# Altium schematic sheet 1_PWR_1.SchDoc
size 419 x 296 mm; Author: Serbinov O.A.; CompanyName: ELSICOM; DrawnBy: Serbinov O.A.; Engineer: Serbinov O.A.; Organization: Elsicom; Address1: Kirova avenue, 58; Address2: Tomsk; Address3: Russia 634012; DocumentNumber: 2; SheetNumber: 2; SheetTotal: 44; ProjectName: 48_PORTS
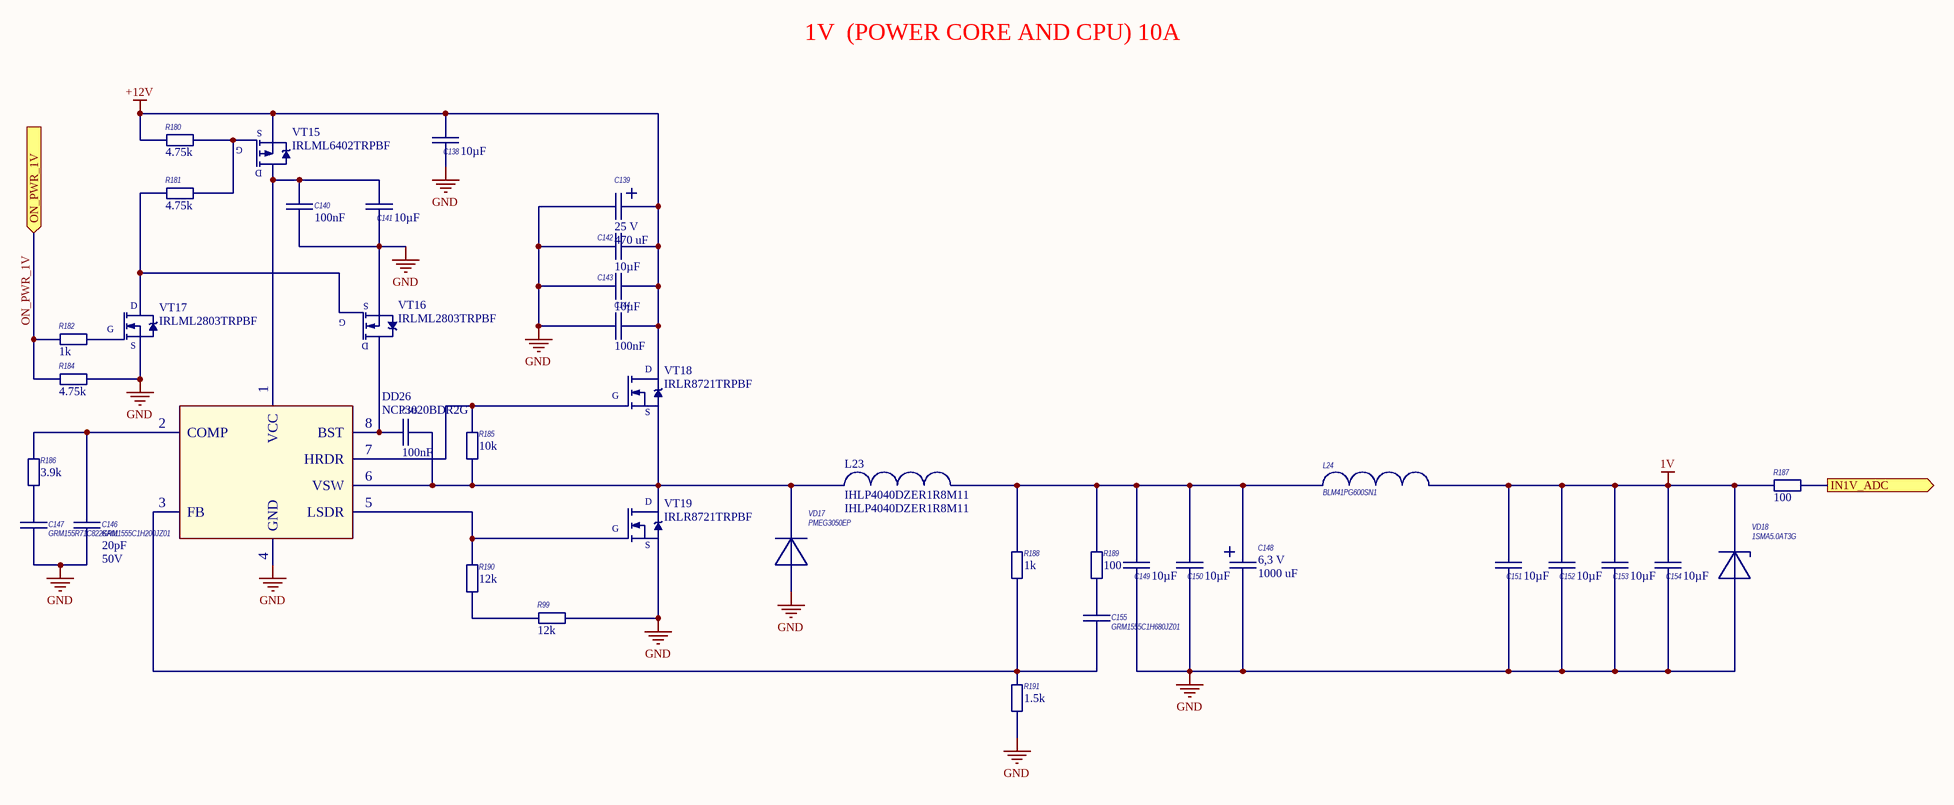
[diagram p0: 1_PWR_1.SchDoc]

## Parts
C138  Capacitance: 10µF  [CAPC2012[0805]]  (hidden comment: GRM21BR61C106KE15)
C139  Voltage Rating: 25 V  Capacitance: 470 uF  [CAP SMD 1010]  (hidden comment: CA025M0470REG-1010)
C140  Capacitance: 100nF  [C0402_IPC High Density]  (hidden comment: GRM155R71E104KE14D)
C141  Capacitance: 10µF  [CAPC2012[0805]]  (hidden comment: GRM21BR61C106KE15)
C142  Capacitance: 10µF  [CAPC2012[0805]]  (hidden comment: GRM21BR61C106KE15)
C143  Capacitance: 10µF  [CAPC2012[0805]]  (hidden comment: GRM21BR61C106KE15)
C144  Capacitance: 100nF  [C0402_IPC High Density]  (hidden comment: GRM155R71E104KE14D)
C145  Capacitance: 100nF  [C0402_IPC High Density]  (hidden comment: GRM155R71E104KE14D)
C146  GRM1555C1H200JZ01  Capacitance: 20pF  Voltage - Rated: 50V  [CAPC1005[0402]]
C147  GRM155R71C822KA01  [CAPC1005[0402]]
C148  Voltage Rating: 6,3 V  Capacitance: 1000 uF  [CAP SMD 1010]  (hidden comment: CA006M1000REG-1010)
C149  Capacitance: 10µF  [CAPC2012[0805]]  (hidden comment: GRM21BR61C106KE15)
C150  Capacitance: 10µF  [CAPC2012[0805]]  (hidden comment: GRM21BR61C106KE15)
C151  Capacitance: 10µF  [CAPC2012[0805]]  (hidden comment: GRM21BR61C106KE15)
C152  Capacitance: 10µF  [CAPC2012[0805]]  (hidden comment: GRM21BR61C106KE15)
C153  Capacitance: 10µF  [CAPC2012[0805]]  (hidden comment: GRM21BR61C106KE15)
C154  Capacitance: 10µF  [CAPC2012[0805]]  (hidden comment: GRM21BR61C106KE15)
C155  GRM1555C1H680JZ01  [CAPC1005[0402]]
DD26  NCP3020BDR2G  [751-07_N]
L23  IHLP4040DZER1R8M11  [IHLP4040DZ]
L24  BLM41PG600SN1  [BLM41P]
R99  Resistance (Ohms): 12k  [R0402_IPC High Density]  (hidden comment: ERJ-2RKF1202X)
R180  Resistance (Ohms): 4.75k  [R0402_IPC High Density]  (hidden comment: ERJ-2RKF4751X)
R181  Resistance (Ohms): 4.75k  [R0402_IPC High Density]  (hidden comment: ERJ-2RKF4751X)
R182  Resistance: 1k  [R0402_IPC High Density]  (hidden comment: ERJ-2RKF1001X)
R184  Resistance (Ohms): 4.75k  [R0402_IPC High Density]  (hidden comment: ERJ-2RKF4751X)
R185  Resistance: 10k  [R0402_IPC High Density]  (hidden comment: ERJ-2RKF1002X)
R186  Resistance: 3.9k  [R0402_IPC High Density]  (hidden comment: ERJ-2RKF3901X)
R187  Resistance: 100  [R0402_IPC High Density]  (hidden comment: ERJ-2RKF1000X)
R188  Resistance: 1k  [R0402_IPC High Density]  (hidden comment: ERJ-2RKF1001X)
R189  Resistance: 100  [R0402_IPC High Density]  (hidden comment: ERJ-2RKF1000X)
R190  Resistance (Ohms): 12k  [R0402_IPC High Density]  (hidden comment: ERJ-2RKF1202X)
R191  Resistance (Ohms): 1.5k  [R0402_IPC High Density]  (hidden comment: ERJ-2RKF1501X)
VD17  PMEG3050EP  [SOD128]
VD18  1SMA5.0AT3G  [SMA]
VT15  IRLML6402TRPBF  [SOT-23]
VT16  IRLML2803TRPBF  [SOT-23]
VT17  IRLML2803TRPBF  [SOT-23]
VT18  IRLR8721TRPBF  [D-PAK (TO-252AA)]
VT19  IRLR8721TRPBF  [D-PAK (TO-252AA)]

## Ports
IN1V_ADC (out), ON_PWR_1V (in)

## Nets
1V: C151.2 C152.2 C153.2 C154.2 L24.2 R187.1 VD18.1
+12V: C138.2 C139.2 C142.2 C143.2 C144.1 R180.2 VT15.2(S) VT18.3(D)
GND: C138.1 C139.1 C140.1 C141.1 C142.1 C143.1 C144.2 C146.1 C147.1 C148.1 C149.1 C150.1 C151.1 C152.1 C153.1 C154.1 DD26.4(GND) R99.1 R184.1 R191.1 VD17.2 VD18.2 VT16.2(S) VT17.2(S) VT19.2(S)
IN1V_ADC: R187.2 ; port IN1V_ADC
ON_PWR_1V: R182.1 R184.2 ; port ON_PWR_1V
NetC140_2: C140.2 C141.2 DD26.1(VCC) VT15.3(D)
NetC145_1: C145.1 DD26.8(BST) VT16.3(D)
NetC145_2: C145.2 DD26.6(VSW) L23.1 R185.1 VD17.1 VT18.2(S) VT19.3(D)
NetC146_2: C146.2 DD26.2(COMP) R186.2
NetC147_2: C147.2 R186.1
NetC148_2: C148.2 C149.2 C150.2 L23.2 L24.1 R188.2 R189.2
NetC155_1: C155.1 DD26.3(FB) R188.1 R191.2
NetC155_2: C155.2 R189.1
NetDD26_5: DD26.5(LSDR) R190.2 VT19.1(G)
NetDD26_7: DD26.7(HRDR) R185.2 VT18.1(G)
NetR99_2: R99.2 R190.1
NetR180_1: R180.1 R181.1 VT15.1(G)
NetR181_2: R181.2 VT16.1(G) VT17.3(D)
NetR182_2: R182.2 VT17.1(G)

## Notes on the sheet
- 1V  (POWER CORE AND CPU) 10A
- A3
- SIZE
- PROJECT
- SHEET
- OF
- Engineer: Oleg Serbinov

## Library data of the parts
C138 C141-C143 C149-C154 = GRM21BR61C106KE15: C0805, 10uF 10%, 16V, X5R; Manufacturer: Murata; Customer Part Number: Конденсатор, 10u, 0805, 16V, X5R, 10%; Analogs: any suitable; Applications: General Purpose; Category: Capacitors; Operating Temperature: -55°C ~ 85°C; Package / Case: 0805 (2012 Metric); Size / Dimension: 0.079" L x 0.049" W (2.00mm x 1.25mm); Temperature Coefficient: X5R; Tolerance: ±10%; ComponentLink1URL: http://search.murata.co.jp/Ceramy/image/img/PDF/ENG/GRM21BR61C106KE15.pdf; ComponentLink1Description: http://search.murata.co.jp/Ceramy/image/img/PDF/ENG/GRM21BR61C106KE15.pdf; Pricing: 1=0.3, 10=0.25, 50=0.1408, 100=0.1252, 250=0.09392, 500=0.08294, 1000=0.07356 (USD); Voltage - Rated: 16V; Manufacturer Part Number: GRM21BR61C106KE15
C139 = CA025M0470REG-1010: Capacitor Aluminium SMD1010, 470uF 25V; Manufacturer: Yageo; Customer Part Number: Конденсатор электролитический, 470u, 1010, 25V; Tolerance: 20 %; Analogs: SC1E477M10010VR259, LV471M025G105ETR, 25SEV470MTM10X10,5; Supplier 1: Mouser; Standard Pack Qty: 500; Category: Aluminum Electrolytic Capacitors - SMD; Reeling: True; Supplier: Mouser; Manufacturer Part Number: CA025M0470REG-1010; Minimum Order Quantity: 1; ComponentLink1URL: http://www.yageo.com/portal/product/productDocs.jsp?YageoPartNumber=CA016M0470REG-1010; ComponentLink1Description: http://www.yageo.com/portal/product/productDocs.jsp?YageoPartNumber=CA016M0470REG-1010; Packaging: Reel; Termination Style: SMD/SMT; Supplier Part Number 1: N/A; Supplier Part Number: N/A
C140 C144 = GRM155R71E104KE14D: C0402, 100nF, 25V, X7R; Manufacturer: Murata; Rmanufacturer: Yageo  Samsung  TDK  Taiyo Yuden  Kemet; Customer Part Number: Конденсатор, 100n, 0402, 25V, X7R, 10%; Capacitance Tolerance: ± 10%; Voltage Rating: 16; Capacitor Case Style: 0402 [1005 Metric]; Capacitor Terminals: SMD; SVHC: No SVHC (19-Dec-2012); No. of Pins: 2; Reel Quantity: 10000; Tolerance +: 10%; Analogs: any suitable; Manufacturer Part Number: GRM155R71E104KE14D; RoHS: YES; Packaging: Reel; Package / Case: 0402; ComponentLink1URL: http://www.farnell.com/datasheets/4360.pdf; ComponentLink1Description: http://www.farnell.com/datasheets/4360.pdf; Pricing: 10000=0.008593, 30000=0.007991 (GBP); Supplier 1: Farnell; Supplier Part Number 1: 1118151; Stock: 3; Dielectric Characteristic: X7R; Operating Temperature Min: -55; Operating Temperature Max: 125; Operating Temperature Range: -55°C to +125; Series: GRM Hi-Cap; Terminal Type: Surface Mount (SMD, SMT); Tolerance -: 10%; Voltage Rating V DC: 16
C145 = GRM155R71E104KE14D: C0402, 100nF, 25V, X7R; Customer Part Number: Конденсатор, 100n, 0402, 25V, X7R, 10%; Manufacturer: Murata; Rmanufacturer: Yageo  Samsung  TDK  Taiyo Yuden  Kemet; Analogs: any suitable; Capacitance Tolerance: ± 10%; Voltage Rating: 16; Capacitor Case Style: 0402 [1005 Metric]; Capacitor Terminals: SMD; SVHC: No SVHC (19-Dec-2012); No. of Pins: 2; Reel Quantity: 10000; Tolerance +: 10%; RoHS: YES; Package / Case: 0402; Manufacturer Part Number: GRM155R71E104KE14D; Packaging: Reel; Supplier 1: Farnell; ComponentLink1URL: http://www.farnell.com/datasheets/4360.pdf; ComponentLink1Description: http://www.farnell.com/datasheets/4360.pdf; Supplier Part Number 1: 1118151; Stock: 3; Pricing: 10000=0.008593, 30000=0.007991 (GBP); Dielectric Characteristic: X7R; Operating Temperature Min: -55; Operating Temperature Max: 125; Operating Temperature Range: -55°C to +125; Series: GRM Hi-Cap; Terminal Type: Surface Mount (SMD, SMT); Tolerance -: 10%; Voltage Rating V DC: 16
C146 = GRM1555C1H200JZ01: C0402, 20pF,  50V, C0G; Manufacturer: Murata; Customer Part Number: Конденсатор, 20p, 0402, 50V, C0G, 5%; Temperature Coefficient: C0G, NP0; Tolerance: ±5%; Analogs: any suitable; Height - Seated (Max): -; Category: Capacitors; Manufacturer Part Number: GRM1555C1H200JZ01; Packaging: Tape & Reel (TR); RoHS: RoHS Compliant; Supplier Part Number: 490-1282-2-ND; Lead Spacing: -; Size / Dimension: 0.039" L x 0.020" W (1.00mm x 0.50mm); Features: -; Supplier: Digi-Key; Mounting Type: Surface Mount, MLCC; Lead Style: -; Ratings: -; Thickness (Max): 0.022" (0.55mm); Package / Case: 0402 (1005 Metric); Applications: General Purpose; Operating Temperature: -55°C ~ 125°C; ComponentLink1URL: http://search.murata.co.jp/Ceramy/image/img/PDF/ENG/GRM1555C1H200JZ01.pdf; ComponentLink1Description: http://search.murata.co.jp/Ceramy/image/img/PDF/ENG/GRM1555C1H200JZ01.pdf; Pricing: 10000=0.01008, 20000=0.0096, 30000=0.00912, 50000=0.00816, 100000=0.0066 (USD)
C147 = GRM155R71C822KA01: C0402, 8.2nF,  50V, X7R; Manufacturer: Murata; Customer Part Number: Конденсатор, 8n2, 0402, 50V, X7R, 10%; Voltage Rating: 16 Volts; Tolerance: 10 %; Temperature Coefficient / Code: 15 %; Capacitance: 8200 pF; Analogs: any suitable; Supplier 1: Mouser; Supplier Part Number 1: 81-GRM155R71C822KA1D; Reeling: True; Product: General Type MLCCs; Standard Pack Qty: 10000; RoHS - Mouser: E; Product Category: Low & Medium Capacitance SMD Ceramic Chip Capacitors; Minimum Order Quantity: 1; Termination Style: SMD/SMT; Packaging: Reel; Series: GRM; Supplier Part Number: 81-GRM155R71C822KA1D; RoHS: RoHS Compliant By Exemption; Manufacturer Part Number: GRM155R71C822KA01; Category: Multilayer Ceramic Capacitors (MLCC) - SMD/SMT; Supplier: Mouser; Package / Case: 0402 (1005 metric); Dimensions: 0.5 mm W x 1 mm L x 0.5 mm H; Operating Temperature Range: - 55 C to + 125 C; ComponentLink1URL: http://www.murata.com/products/catalog/pdf/c02e.pdf; ComponentLink1Description: http://www.murata.com/products/catalog/pdf/c02e.pdf
C148 = CA006M1000REG-1010: Capacitor Aluminium SMD1010, 1000uF 6,3V; Manufacturer: Yageo; Customer Part Number: Конденсатор электролитический, 1000u, 1010, 6.3V; Tolerance: 20 %; Analogs: CZ010M1000RSG-1010; Supplier 1: Mouser; Standard Pack Qty: 500; Category: Aluminum Electrolytic Capacitors - SMD; Reeling: True; Supplier: Mouser; Manufacturer Part Number: CA006M1000REG-1010; Minimum Order Quantity: 1; ComponentLink1URL: http://www.yageo.com/portal/product/productDocs.jsp?YageoPartNumber=CA016M0470REG-1010; ComponentLink1Description: http://www.yageo.com/portal/product/productDocs.jsp?YageoPartNumber=CA016M0470REG-1010; Packaging: Reel; Termination Style: SMD/SMT; Supplier Part Number 1: N/A; Supplier Part Number: N/A
C155 = GRM1555C1H680JZ01: C0402, 68pF,  50V, C0G; Manufacturer: Murata; Customer Part Number: Конденсатор, 68p, 0402, 50V, C0G, 5%; Tolerance: ±5%; Temperature Coefficient: C0G, NP0; Analogs: any suitable; Supplier 1: Digi-Key; Supplier Part Number 1: 490-1289-1-ND; Height - Seated (Max): -; Lead Style: -; Lead Spacing: -; Packaging: Cut Tape (CT); Applications: General Purpose; Package / Case: 0402 (1005 Metric); Thickness (Max): 0.022" (0.55mm); Size / Dimension: 0.039" L x 0.020" W (1.00mm x 0.50mm); Ratings: -; Features: -; Supplier: Digi-Key; Supplier Part Number: 490-1289-1-ND; Category: Capacitors; Operating Temperature: -55°C ~ 125°C; Manufacturer Part Number: GRM1555C1H680JZ01; Mounting Type: Surface Mount, MLCC; RoHS: RoHS Compliant; ComponentLink1URL: http://search.murata.co.jp/Ceramy/image/img/PDF/ENG/GRM1555C1H680JZ01.pdf; ComponentLink1Description: http://search.murata.co.jp/Ceramy/image/img/PDF/ENG/GRM1555C1H680JZ01.pdf; Pricing: 1=0.1, 10=0.035, 50=0.0188, 100=0.016, 250=0.01304, 500=0.01116, 1000=0.0087, 5000=0.00725 (USD); Capacitance: 68pF; Voltage - Rated: 50V
DD26 = NCP3020BDR2G: IC PWM Controller 600 kHz NCP3020BDR2G; Manufacturer: ON Semiconductor; Customer Part Number: Микросхема, NCP3020BDR2G, IC REG CTRLR BUCK, 8-SOIC; Number of Outputs: Single Output; Output Current: 5.9 mA to 7.8 mA; Operating Supply Voltage: 4.7 V to 28 V; Supplier 1: Mouser; Reeling: True; Manufacturer Part Number: NCP3020BDR2G; Category: Soft Switching PWM Controllers; Maximum Operating Temperature: + 140 C; Minimum Order Quantity: 1; Package / Case: SOIC-8; Minimum Operating Temperature: - 40 C; Supplier: Mouser; Mounting Style: SMD/SMT; Packaging: Reel; RoHS - Mouser: Y; RoHS: RoHS Compliant; ComponentLink1URL: http://www.onsemi.com/pub/Collateral/NCP3020-D.PDF; ComponentLink1Description: http://www.onsemi.com/pub/Collateral/NCP3020-D.PDF; Pricing: 1=1.08, 10=0.957, 25=0.864, 100=0.756, 250=0.663, 500=0.588, 1000=0.465 (USD); Supplier Part Number 1: 863-NCP3020BDR2G; Supplier Part Number: 863-NCP3020BDR2G; Analogs: *
L23 = IHLP4040DZER1R8M11: INDUCTOR 1.8UH 16A; Manufacturer: Vishay Dale; Customer Part Number: Дроссель, IHLP4040DZER1R8M11, FIXED IND 1.8UH 17A 5 MOHM SMD; Frequency - Test: 100kHz; Shielding: Shielded; Current Rating: 17A; Inductance: 1.8µH; Tolerance: ±20%; DC Resistance (DCR): 5 mOhm Max; RoHS: RoHS Compliant; Package / Case: Non Standard; Type: -; Mounting Type: Surface Mount; Frequency - Self Resonant: -; Material - Core: -; Category: Inductors, Coils, Chokes; Size / Dimension: 0.453" L x 0.405" W x 0.158" H (11.50mm x 10.30mm x 4.00mm); Current - Saturation: 16A; Packaging: Tape & Reel (TR); Q @ Freq: -; Supplier: Digi-Key; Operating Temperature: -55°C ~ 125°C; ComponentLink1URL: http://www.vishay.com/docs/34192/lp40dz11.pdf; ComponentLink1Description: http://www.vishay.com/docs/34192/lp40dz11.pdf; Pricing: 500=1.156, 2500=1.088, 5000=1.02, 12500=0.952, 25000=0.884 (USD); Supplier Part Number: 541-1313-2-ND; Manufacturer Part Number: IHLP4040DZER1R8M11
L24 = BLM41PG600SN1: FILTER BLM41 (1806, 6A); Manufacturer: Murata; Manufacturer Part Number: BLM41PG600SN1L; Customer Part Number: Дроссель, BLM41PG600SN1, FERRITE BEAD 60 Omh, 1806; DC Resistance Max: 0.01; Impedance: 60; External Depth: 4.5; External Width: 1.6; Inductor Type: Ferrite Bead; SVHC: No SVHC (19-Dec-2011); No. of Pins: 2; Inductor Case Style: 1806; Core Material: Ferrite; Analogs: UPB451616T-600Y-N CHILISIN; Supplier 1: Digi-Key; Supplier Part Number 1: 490-1058-2-ND; Series: BLM41; RoHS: YES; Supplier: Farnell; Supplier Part Number: 9526900; Termination Type: SMD; External Length / Height: 1.6; ComponentLink1URL: http://search.murata.co.jp/Ceramy/image/img/PDF/ENG/L0110S0100BLM41P.pdf; ComponentLink1Description: http://search.murata.co.jp/Ceramy/image/img/PDF/ENG/L0110S0100BLM41P.pdf; Pricing: 10=0.28, 50=0.21, 100=0.164, 500=0.117, 1000=0.107 (GBP); DC Current Rating: 6A; Ferrite Bead 60 Ом, 6 А: BLM41PG600SN1
R99 R190 = ERJ-2RKF1202X: R0402, 12k 1%; Manufacturer: Panasonic; Rpart number: RC0402FR-0712KL ; RC1005F123CS ; RMCF0402FT12K0 ; MCR01MRTF1202 ; CRCW040212K0FKED; Rmanufacturer: Yageo  Samsung  Stackpole Electronics  Rohm Semiconductor  Vishay Dale; Customer Part Number: Резистор, 12K, 0402, 1%; Temperature Coefficient: ±100ppm/°C; Power (Watts): 0.1W, 1/10W; Analogs: any suitable; Features: -; Composition: Thick Film; Package / Case: 0402 (1005 Metric); RoHS: RoHS Compliant; Supplier Part Number: P12.0KLCT-ND; Manufacturer Part Number: ERJ-2RKF1202X; Size / Dimension: 0.039" L x 0.020" W (1.00mm x 0.50mm); Tolerance: ±1%; Number of Terminations: 2; Height: 0.016" (0.40mm); Packaging: Cut Tape (CT); Supplier: Digi-Key; Category: Resistors; ComponentLink1URL: http://industrial.panasonic.com/www-cgi/jvcr13pz.cgi?E+PZ+3+AOA0002+ERJ2RKF1202X+7+WW; ComponentLink1Description: http://industrial.panasonic.com/www-cgi/jvcr13pz.cgi?E+PZ+3+AOA0002+ERJ2RKF1202X+7+WW; Pricing: 1=0.1, 50=0.0242, 100=0.0184, 250=0.01364, 500=0.01008, 1000=0.00672, 5000=0.00473 (USD); Supplier 1: Digi-Key; Supplier Device Package: 0402; Supplier Part Number 1: P12.0KLCT-ND
R180 R181 R184 = ERJ-2RKF4751X: R0402, 4.75k 1%; Manufacturer: Panasonic; Rpart number: RC0402FR-074K75L ; RC1005F4751CS ; RMCF0402FT4K75 ; CRCW04024K75FKED ; TRR01MZPF4751; Rmanufacturer: Yageo  Samsung  Stackpole Electronics  Rohm Semiconductor  Vishay Dale; Customer Part Number: Резистор, 4K75, 0402, 1%; Temperature Coefficient: ±100ppm/°C; Power (Watts): 0.1W, 1/10W; Analogs: any suitable; Tolerance: ±1%; Packaging: Cut Tape (CT); Package / Case: 0402 (1005 Metric); Category: Resistors; Manufacturer Part Number: ERJ-2RKF4751X; Supplier Part Number: P4.75KLCT-ND; RoHS: RoHS Compliant; Supplier: Digi-Key; ComponentLink1URL: http://industrial.panasonic.com/www-cgi/jvcr13pz.cgi?E+PZ+3+AOA0002+ERJ2RKF4751X+7+WW; ComponentLink1Description: http://industrial.panasonic.com/www-cgi/jvcr13pz.cgi?E+PZ+3+AOA0002+ERJ2RKF4751X+7+WW; Features: -; Composition: Thick Film; Height: 0.016" (0.40mm); Number of Terminations: 2; Supplier Device Package: 0402; Size / Dimension: 0.039" L x 0.020" W (1.00mm x 0.50mm)
R182 R188 = ERJ-2RKF1001X: R0402, 1k 1%; Manufacturer: Panasonic; Rpart number: RC0402FR-071KL ; RC1005F102CS ; RMCF0402FT1K00 ; MCR01MRTF1001 ; CRCW04021K00FKED ; ERJ2RKF1001X; Rmanufacturer: Yageo  Samsung  Stackpole Electronics  Rohm Semiconductor  Vishay Dale; Customer Part Number: Резистор, 1K, 0402, 1%; Temperature Coefficient: 100 PPM / C; Power Rating: 100 mWatts; Voltage Rating: 50 Volts; Analogs: any suitable; Supplier: Mouser; Termination Style: SMD/SMT; Series: ERJ; Supplier Part Number: 667-ERJ-2RKF1001X; RoHS: RoHS Compliant By Exemption; Dimensions: 0.5 mm W x 1 mm L x 0.35 mm H; Package / Case: 0402 (1005 metric); Product Category: .; Manufacturer Part Number: ERJ-2RKF1001X; Packaging: Reel; Tolerance: 1 %; Operating Temperature Range: - 55 C to + 155 C; Category: Thick Film Resistors - SMD; Product: Thick Film Resistors SMD; Reeling: True; Minimum Order Quantity: 1; RoHS - Mouser: E; Standard Pack Qty: 10000; ComponentLink1URL: http://industrial.panasonic.com/www-data/pdf/AOA0000/AOA0000CE2.pdf; ComponentLink1Description: http://industrial.panasonic.com/www-data/pdf/AOA0000/AOA0000CE2.pdf; Pricing: 1=0.135, 25=0.032, 100=0.024, 250=0.018, 500=0.014, 1000=0.008, 2000=0.007, 5000=0.004 (AUD)
R185 = ERJ-2RKF1002X: R0402, 10k 1%; Manufacturer: Panasonic; Rpart number: RC0402FR-0710KL ; RC1005F103CS ; RMCF0402FT10K0 ; MCR01MZPF1002 ; MCR01MRTF1002; Rmanufacturer: Yageo  Samsung  Stackpole Electronics  Rohm Semiconductor  Vishay Dale; Customer Part Number: Резистор, 10K, 0402, 1%; Power Rating: 100 mWatts; Voltage Rating: 50 Volts; Temperature Coefficient: 100 PPM / C; Analogs: any suitable; Minimum Order Quantity: 1; Supplier Part Number: 667-ERJ-2RKF1002X; Packaging: Reel; Product: Thick Film Resistors SMD; Package / Case: 0402 (1005 metric); Category: Thick Film Resistors - SMD; Supplier: Mouser; Manufacturer Part Number: ERJ-2RKF1002X; RoHS: RoHS Compliant By Exemption; Operating Temperature Range: - 55 C to + 155 C; Dimensions: 0.5 mm W x 1 mm L x 0.35 mm H; Reeling: True; Series: ERJ; Product Category: .; Standard Pack Qty: 10000; Termination Style: SMD/SMT; Tolerance: 1 %; RoHS - Mouser: E; ComponentLink1URL: http://industrial.panasonic.com/www-data/pdf/AOA0000/AOA0000CE2.pdf; ComponentLink1Description: http://industrial.panasonic.com/www-data/pdf/AOA0000/AOA0000CE2.pdf; Pricing: 1=0.135, 25=0.032, 100=0.024, 250=0.018, 500=0.014, 1000=0.008, 2000=0.007, 5000=0.004 (AUD)
R186 = ERJ-2RKF3901X: R0402, 3.9k 1%; Manufacturer: Panasonic; Rpart number: RC0402FR-073K9L ; RC1005F392CS ; RMCF0402FT3K90 ; MCR01MRTF3901 ; CRCW04023K90FKED; Rmanufacturer: Yageo  Samsung  Stackpole Electronics  Rohm Semiconductor  Vishay Dale; Customer Part Number: Резистор, 3K9, 0402, 1%; Power Rating: 100 mWatts; Temperature Coefficient: 100 PPM / C; Voltage Rating: 50 Volts; Analogs: any suitable; Reeling: True; RoHS - Mouser: E; Standard Pack Qty: 10000; Product Category: .; Minimum Order Quantity: 1; Product: Thick Film Resistors SMD; Package / Case: 0402 (1005 metric); Operating Temperature Range: - 55 C to + 155 C; Series: ERJ; RoHS: RoHS Compliant By Exemption; Dimensions: 0.5 mm W x 1 mm L x 0.35 mm H; Packaging: Reel; Supplier Part Number: 667-ERJ-2RKF3901X; Supplier: Mouser; Category: Thick Film Resistors - SMD; Manufacturer Part Number: ERJ-2RKF3901X; Tolerance: 1 %; Termination Style: SMD/SMT; ComponentLink1URL: http://industrial.panasonic.com/www-data/pdf/AOA0000/AOA0000CE2.pdf; ComponentLink1Description: http://industrial.panasonic.com/www-data/pdf/AOA0000/AOA0000CE2.pdf; Pricing: 1=0.135, 25=0.032, 100=0.024, 250=0.018, 500=0.014, 1000=0.008, 2000=0.007, 5000=0.004 (AUD)
R187 R189 = ERJ-2RKF1000X: R0402, 100R 1%; Manufacturer: Panasonic; Rpart number: RC0402FR-07100RL ; RC1005F101CS ; CRG0402F100R ; RMCF0402FT100R ; MCR01MZPF1000 ; MCR01MZPJ101; Rmanufacturer: Yageo  Samsung  Stackpole Electronics  Rohm Semiconductor  Vishay Dale; Customer Part Number: Резистор, 100R, 0402, 1%; Temperature Coefficient: 100 PPM / C; Voltage Rating: 50 Volts; Power Rating: 100 mWatts; Analogs: any suitable; Supplier: Mouser; Category: Thick Film Resistors - SMD; Package / Case: 0402 (1005 metric); Tolerance: 1 %; RoHS: RoHS Compliant By Exemption; Packaging: Reel; ComponentLink1URL: http://industrial.panasonic.com/www-data/pdf/AOA0000/AOA0000CE2.pdf; ComponentLink1Description: http://industrial.panasonic.com/www-data/pdf/AOA0000/AOA0000CE2.pdf; Minimum Order Quantity: 1; Series: ERJ; Product: Thick Film Resistors SMD; RoHS - Mouser: E; Reeling: True; Termination Style: SMD/SMT; Standard Pack Qty: 10000; Operating Temperature Range: - 55 C to + 155 C; Dimensions: 0.5 mm W x 1 mm L x 0.35 mm H; Manufacturer Part Number: ERJ-2RKF1000X
R191 = ERJ-2RKF1501X: R0402, 1.5k 1%; Manufacturer: Panasonic; Rpart number: RC0402FR-071K5L ; RC1005F152CS ; RMCF0402FT1K50 ; MCR01MRTF1501 ; CRCW04021K50FKED ; RC-02W152FT; Rmanufacturer: Yageo  Samsung  Stackpole Electronics  Rohm Semiconductor  Vishay Dale; Customer Part Number: Резистор, 1K5, 0402, 1%; Power (Watts): 0.1W, 1/10W; Temperature Coefficient: ±100ppm/°C; Analogs: any suitable; RoHS: RoHS Compliant; Manufacturer Part Number: ERJ-2RKF1501X; Category: Resistors; Supplier: Digi-Key; Features: -; Composition: Thick Film; Supplier Device Package: 0402; Number of Terminations: 2; Packaging: Tape & Reel (TR); Size / Dimension: 0.039" L x 0.020" W (1.00mm x 0.50mm); Tolerance: ±1%; Package / Case: 0402 (1005 Metric); Height: 0.016" (0.40mm); Supplier 1: Digi-Key; Pricing: 10000=0.00347, 30000=0.00305, 50000=0.00279, 100000=0.00274 (USD); ComponentLink1URL: http://industrial.panasonic.com/www-cgi/jvcr13pz.cgi?E+PZ+3+AOA0002+ERJ2RKF1501X+7+WW; ComponentLink1Description: http://industrial.panasonic.com/www-cgi/jvcr13pz.cgi?E+PZ+3+AOA0002+ERJ2RKF1501X+7+WW; Supplier Part Number: P1.50KLTR-ND; Supplier Part Number 1: P1.50KLTR-ND
VD17 = PMEG3050EP: DIODE 5 A 30 V Schottky barrier rectifier; Manufacturer: NXP Semiconductors; Customer Part Number: Диод, PMEG3050EP.115, DIODE SCHOTTKY 30V 5A, SOD-128; Speed: Fast Recovery =< 500ns, > 200mA (Io); Capacitance @ Vr, F: 800pF @ 1V, 1MHz; Current - Reverse Leakage @ Vr: 8mA @ 30V; Voltage - Forward (Vf) (Max) @ If: 360mV @ 5A; Current - Average Rectified (Io): 5A; Voltage - DC Reverse (Vr) (Max): 30V; Category: Discrete Semiconductor Products; Supplier: Digi-Key; Package / Case: SOD-128; Supplier Device Package: SOD-128; Manufacturer Part Number: PMEG3050EP; Packaging: Digi-Reel®; RoHS: RoHS Compliant; Diode Type: Schottky; Reverse Recovery Time (trr): -; Mounting Type: Surface Mount; Supplier Part Number: 568-6753-6-ND; ComponentLink1URL: http://www.nxp.com/documents/data_sheet/PMEG3050EP.pdf; ComponentLink1Description: http://www.nxp.com/documents/data_sheet/PMEG3050EP.pdf; Pricing: 1=0.52, 10=0.437, 25=0.3828, 100=0.3275, 250=0.28408, 500=0.24062, 1000=0.1855 (USD)
VD18 = 1SMA5.0AT3G: DIODE TVS 5V 400W SMA; Manufacturer: ON Semiconductor; Customer Part Number: Диод, 1SMA5.0AT3G, TVS DIODE 5VWM 9.2VC SMA; Power Dissipation Pd: 1.5; Peak Pulse Power: 400; Breakdown Voltage: 6.7; Reverse Stand-Off Voltage Vrwm: 5; No. of Pins: 2; Breakdown Voltage Range: 6.4V to 7; Diode Configuration: Unidirectional; Peak Pulse Current Ippm: 43.5; SVHC: No SVHC (18-Jun-2012); Capacitance Cd @ Vr Typ: 2035; Clamping Voltage Vc Max: 9.3; Diode Type: TVS, Unidirectional; Analogs: P4SMAJ5.0CA-TN-LF; Termination Type: SMD; Package / Case: SMA; Manufacturer Part Number: 1SMA5.0AT3G; Supplier: Farnell; Stand-off Voltage: 5; Operating Temperature Range: -65°C to +150; TVS Polarity: Unidirectional; Diode Case Style: SMA; RoHS: YES; ComponentLink1URL: http://www.onsemi.com/pub/Collateral/1SMA5.0AT3-D.PDF; ComponentLink1Description: http://www.onsemi.com/pub/Collateral/1SMA5.0AT3-D.PDF; Pricing: 1=0.24, 25=0.199, 50=0.181, 100=0.165, 500=0.137 (GBP); Supplier Part Number: 1651634
VT15 = IRLML6402TRPBF: MOSFET P-CH 20V 3.7A SOT23; Manufacturer: International Rectifier; Rpart number: IRLML5203TRPBF ; IRLML6402PbF; Customer Part Number: Транзистор, IRLML6402TRPBF, MOSFET P-CH 20V 3.7A, SOT-23; Input Capacitance (Ciss) @ Vds: 633pF @ 10V; FET Type: MOSFET P-Channel, Metal Oxide; Power - Max: 1.3W; FET Feature: Logic Level Gate; Rds On (Max) @ Id, Vgs: 65 mOhm @ 3.7A, 4.5V; Gate Charge (Qg) @ Vgs: 12nC @ 5V; Vgs(th) (Max) @ Id: 1.2V @ 250µA; Supplier 1: Digi-Key; Category: Discrete Semiconductor Products; Supplier: Digi-Key; Current - Continuous Drain (Id) @ 25° C: 3.7A; Mounting Type: Surface Mount; RoHS: RoHS Compliant; Manufacturer Part Number: IRLML6402TRPBF; Packaging: Tape & Reel (TR); Package / Case: TO-236-3, SC-59, SOT-23-3; Supplier Device Package: Micro3™/SOT-23; Drain to Source Voltage (Vdss): 20V; ComponentLink1URL: http://www.irf.com/product-info/datasheets/data/irlml6402pbf.pdf; ComponentLink1Description: http://www.irf.com/product-info/datasheets/data/irlml6402pbf.pdf; Pricing: 3000=0.155, 6000=0.14523, 15000=0.13896, 30000=0.13355, 75000=0.12719, 150000=0.12273 (USD); Supplier Part Number 1: IRLML6402PBFTR-ND; Supplier Part Number: IRLML6402PBFTR-ND; Rmanufacturer: International Rectifier; Analogs: IRLML5203TRPBF ; IRLML6402PbF
VT16 VT17 = IRLML2803PBF: MOSFET N-CH 30V 1.2A SOT23; Manufacturer: International Rectifier; Rpart number: IRLML2402TRPBF ; IRLML2402PBF ; IRLML2803TRPbF; Customer Part Number: Транзистор, IRLML2803TRPBF, MOSFET N-CH 30V 1.2A, SOT-23; Vgs(th) (Max) @ Id: 1V @ 250µA; FET Type: MOSFET N-Channel, Metal Oxide; Rds On (Max) @ Id, Vgs: 250 mOhm @ 910mA, 10V; FET Feature: Logic Level Gate; Input Capacitance (Ciss) @ Vds: 85pF @ 25V; Power - Max: 540mW; Gate Charge (Qg) @ Vgs: 5nC @ 10V; Category: Discrete Semiconductor Products; Mounting Type: Surface Mount; Supplier: Digi-Key; Drain to Source Voltage (Vdss): 30V; Packaging: Cut Tape (CT); RoHS: RoHS Compliant; Manufacturer Part Number: IRLML2803TRPBF; Supplier Device Package: Micro3™/SOT-23; Current - Continuous Drain (Id) @ 25° C: 1.2A; Package / Case: TO-236-3, SC-59, SOT-23-3; ComponentLink1URL: http://www.irf.com/product-info/datasheets/data/irlml2803pbf.pdf; ComponentLink1Description: http://www.irf.com/product-info/datasheets/data/irlml2803pbf.pdf; Supplier Part Number: IRLML2803PBFCT-ND; Rmanufacturer: International Rectifier; Analogs: IRLML2402TRPBF ; IRLML2402PBF ; IRLML2803TRPbF
VT18 VT19 = IRLR8721PbF: MOSFET N-CH 30V 65A D-Pak; Manufacturer: International Rectifier; Customer Part Number: Транзистор, IRLR8721TRPBF, MOSFET N-CH 30V 65A, D-Pak; Transistor Polarity: N Channel; Rds(on) Test Voltage Vgs: 10; On Resistance Rds(on): 8.4; Continuous Drain Current Id: 65; Threshold Voltage Vgs Typ: 1.9; Drain Source Voltage Vds: 30; Supplier: Newark; Manufacturer Part Number: IRLR8721TRPBF; RoHS: YES; ComponentLink1URL: http://www.irf.com/product-info/datasheets/data/irlr8721pbf.pdf; ComponentLink1Description: http://www.irf.com/product-info/datasheets/data/irlr8721pbf.pdf; Pricing: 1=1.23, 10=0.767, 100=0.561, 250=0.527, 500=0.495, 1000=0.464 (USD); Supplier Part Number: 58M7442; Analogs: IRLR8721TRPBF